# Altium schematic sheet AMP.SchDoc
size A4
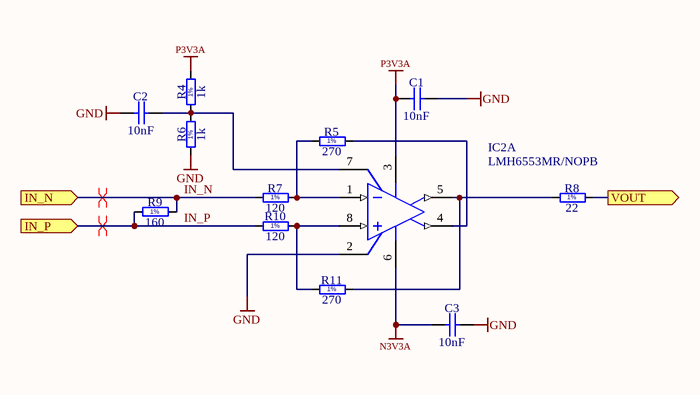
[diagram p0: AMP.SchDoc]

## Parts
C1  10nF  [CAPC1608X87N]
C2  10nF  [CAPC1608X87N]
C3  10nF  [CAPC1608X87N]
IC2  LMH6553MR/NOPB  [DDA0008D_M]  (part A of 2)
R4  1k  [RESC1608X55N]
R5  270  [RESC1608X55N]
R6  1k  [RESC1608X55N]
R7  120  [RESC1608X55N]
R8  22  [RESC1608X55N]
R9  160  [RESC1608X55N]
R10  120  [RESC1608X55N]
R11  270  [RESC1608X55N]

## Ports
IN_N (in), IN_P (in), VOUT (out)

## Nets
GND: C1.2 C2.1 C3.2 IC2.2(VCM) R6.1
N3V3A: C3.1 IC2.6(V-)
P3V3A: C1.1 IC2.3(V+) R4.2
IN_N: R7.1 R9.2 ; port IN_N
IN_P: R9.1 R10.1 ; port IN_P
VOUT: R8.2 ; port VOUT
NetC2_2: C2.2 IC2.7(VCLAMP) R4.1 R6.2
NetIC2_1: IC2.1(IN-) R5.1 R7.2
NetIC2_4: IC2.4(OUT+) R5.2
NetIC2_5: IC2.5(OUT-) R8.1 R11.2
NetIC2_8: IC2.8(IN+) R10.2 R11.1

## Layout directives
differential pair: IN_N, IN_P

## Notes on the sheet
- (in symbol R0603_1K_1%_0.1W_100PPM) 1%
- (in symbol R0603_22R_1%_0.1W_100PPM) 1%
- (in symbol R0603_120R_1%_0.1W_100PPM) 1%
- (in symbol R0603_160R_1%_0.1W_100PPM) 1%
- (in symbol R0603_270R_1%_0.1W_100PPM) 1%

## Library data of the parts
C1-C3 = CC0603_10NF_50V_10%_X7R: Non-polarised capacitor; Part Description: SMD Multilayer Chip Ceramic Capacitor; Manufacturer: GENERIC; Manufacturer1 Part Number: 223858615636; Voltage: 50V; TC: X7R; Tolerance: ±10%; Part Number: CC0603_10NF_50V_10%_X7R; Component Kind: Standard; Component Type: Standard; Pin Count: 2; Value: 10nF; Status: Preferred; Manufacturer Part Number: CC0603_10NF_50V_10%_X7R; Case: 0603; Mounted: Yes; Socket: No; SMD: Yes; Sense: No; Manufacturer1 Example: PHYCOMP; Manufacturer1 ComponentHeight: 0.87mm; HelpURL: \\cern.ch\dfs\Applications\Altium\Datasheets\CC0603_X7R_PHYCOMP.pdf; Author: CERN DEM JLC; CreateDate: 03/12/2007; LatestRevisionDate: 03/12/2007
IC2 = CMP-0055-00335-3: 900 MHz Fully Differential Amplifier with Output Limiting Clamp, 8-pin PSOP, Pb-Free; Manufacturer: Texas Instruments; CompType: Amplifiers; PowerWise: Y; PackageTopMarking: NSXYTT*LMH65*53MR; ComponentLink1Description: Datasheet URL; PinCount: 8; RoHS: Y; Package Reference: DDA0008D; PackageDescription: Molded, PSOP .193 x .154 x .058in, 8 Lead, .050in Pitch, Large DAP; ComponentLink1URL: http://www.ti.com/general/docs/lit/getliterature.tsp?genericPartNumber=LMH6553&fileType=pdf; Code_JEDEC: MS-012-AA
R4 R6 = R0603_1K_1%_0.1W_100PPM: Resistor - 1%; Part Description: General Purpose Thick Film Chip Resistor; Manufacturer: GENERIC; Manufacturer1 Part Number: NRC06F1001TRF; Power: 0.1W; TC: ±100ppm/°C; PressFit: No; Part Number: R0603_1K_1%_0.1W_100PPM; Component Kind: Standard; Component Type: Standard; Pin Count: 2; Value: 1k; Status: Preferred; Tolerance: ±1%; Manufacturer Part Number: R0603_1K_1%_0.1W_100PPM; Case: 0603; Mounted: Yes; Sense: No; Socket: No; SMD: Yes; Manufacturer1 ComponentHeight: 0.55mm; HelpURL: \\cern.ch\dfs\Applications\Altium\Datasheets\R0603_NIC_NRC.pdf; Author: CERN DEM JLC; CreateDate: 03/12/2007; LatestRevisionDate: 13/03/2008; Manufacturer1 Example: NIC COMPONENT
R5 R11 = R0603_270R_1%_0.1W_100PPM: Resistor - 1%; Part Description: General Purpose Thick Film Chip Resistor; Manufacturer: GENERIC; Manufacturer1 Part Number: NRC06F2700TRF; Power: 0.1W; TC: ±100ppm/°C; PressFit: No; Part Number: R0603_270R_1%_0.1W_100PPM; Component Kind: Standard; Component Type: Standard; Pin Count: 2; Value: 270; Status: Preferred; Tolerance: ±1%; Manufacturer Part Number: R0603_270R_1%_0.1W_100PPM; Case: 0603; Mounted: Yes; Sense: No; Socket: No; SMD: Yes; Manufacturer1 Example: NIC COMPONENT; Manufacturer1 ComponentHeight: 0.55mm; HelpURL: \\cern.ch\dfs\Applications\Altium\Datasheets\R0603_NIC_NRC.pdf; Author: CERN DEM JLC; CreateDate: 03/12/2007; LatestRevisionDate: 13/03/2008
R7 R10 = R0603_120R_1%_0.1W_100PPM: Resistor - 1%; Part Description: General Purpose Thick Film Chip Resistor; Manufacturer: GENERIC; Manufacturer1 Part Number: NRC06F1200TRF; Power: 0.1W; TC: ±100ppm/°C; PressFit: No; Part Number: R0603_120R_1%_0.1W_100PPM; Component Kind: Standard; Component Type: Standard; Pin Count: 2; Value: 120; Status: Preferred; Tolerance: ±1%; Manufacturer Part Number: R0603_120R_1%_0.1W_100PPM; Case: 0603; Mounted: Yes; Sense: No; Socket: No; SMD: Yes; Manufacturer1 Example: NIC COMPONENT; Manufacturer1 ComponentHeight: 0.55mm; HelpURL: \\cern.ch\dfs\Applications\Altium\Datasheets\R0603_NIC_NRC.pdf; Author: CERN DEM JLC; CreateDate: 03/12/2007; LatestRevisionDate: 13/03/2008
R8 = R0603_22R_1%_0.1W_100PPM: Resistor - 1%; Part Description: General Purpose Thick Film Chip Resistor; Manufacturer: GENERIC; Manufacturer1 Part Number: NRC06F22R0TRF; Power: 0.1W; TC: ±100ppm/°C; PressFit: No; Part Number: R0603_22R_1%_0.1W_100PPM; Component Kind: Standard; Component Type: Standard; Pin Count: 2; Value: 22; Status: Preferred; Tolerance: ±1%; Manufacturer Part Number: R0603_22R_1%_0.1W_100PPM; Case: 0603; Mounted: Yes; Sense: No; Socket: No; SMD: Yes; Manufacturer1 Example: NIC COMPONENT; Manufacturer1 ComponentHeight: 0.55mm; HelpURL: \\cern.ch\dfs\Applications\Altium\Datasheets\R0603_NIC_NRC.pdf; Author: CERN DEM JLC; CreateDate: 03/12/2007; LatestRevisionDate: 13/03/2008
R9 = R0603_160R_1%_0.1W_100PPM: Resistor - 1%; Part Description: General Purpose Thick Film Chip Resistor; Manufacturer: GENERIC; Manufacturer1 Part Number: NRC06F1600TRF; Power: 0.1W; TC: ±100ppm/°C; PressFit: No; Part Number: R0603_160R_1%_0.1W_100PPM; Component Kind: Standard; Component Type: Standard; Pin Count: 2; Value: 160; Status: Preferred; Tolerance: ±1%; Manufacturer Part Number: R0603_160R_1%_0.1W_100PPM; Case: 0603; Mounted: Yes; Sense: No; Socket: No; SMD: Yes; Manufacturer1 Example: NIC COMPONENT; Manufacturer1 ComponentHeight: 0.55mm; HelpURL: \\cern.ch\dfs\Applications\Altium\Datasheets\R0603_NIC_NRC.pdf; Author: CERN DEM JLC; CreateDate: 03/12/2007; LatestRevisionDate: 13/03/2008